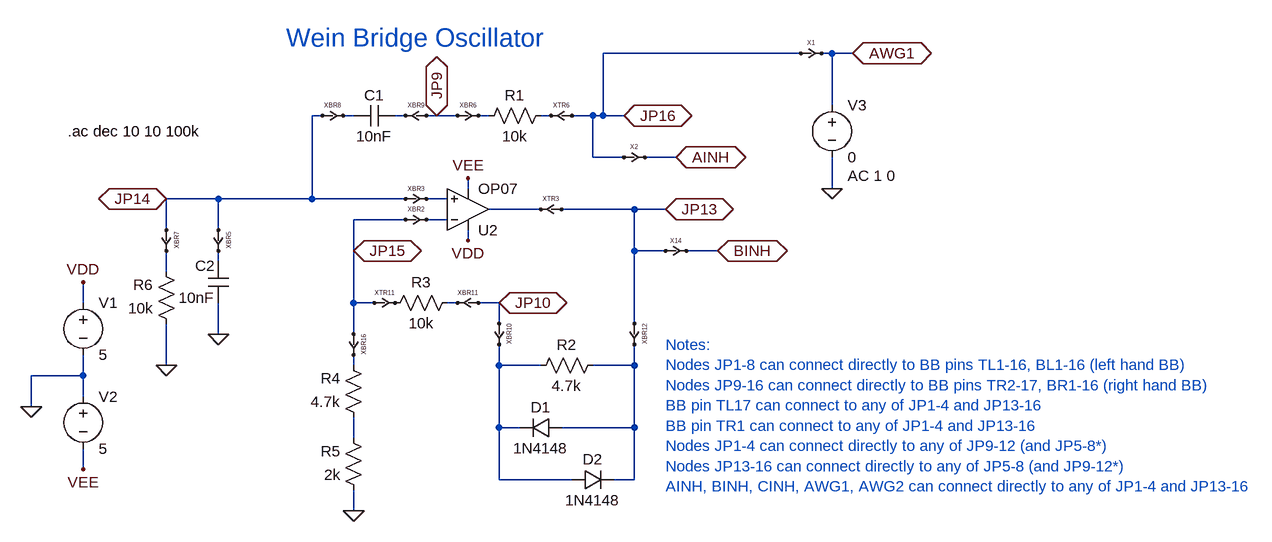
[diagram p0: schematic wien_bridge_osc_ac_response.asc]
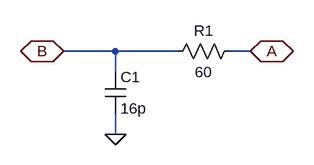
[diagram p1: sub-circuit cross_point.asc]
wien_bridge_osc_ac_response.asc, the LTspice schematic file:
Version 4
SHEET 1 1728 820
WIRE 768 0 464 0
WIRE 816 0 800 0
WIRE 848 0 816 0
WIRE 816 80 816 0
WIRE 32 96 16 96
WIRE 80 96 64 96
WIRE 160 96 144 96
WIRE 208 96 192 96
WIRE 240 96 208 96
WIRE 288 96 272 96
WIRE 384 96 368 96
WIRE 448 96 416 96
WIRE 464 96 464 0
WIRE 464 96 448 96
WIRE 496 96 464 96
WIRE 448 160 448 96
WIRE 496 160 448 160
WIRE 576 160 528 160
WIRE 256 208 256 192
WIRE 816 208 816 160
WIRE -128 224 -208 224
WIRE 16 224 16 96
WIRE 16 224 -128 224
WIRE 160 224 16 224
WIRE 224 224 192 224
WIRE 368 240 288 240
WIRE 512 240 400 240
WIRE 560 240 512 240
WIRE 160 256 80 256
WIRE 224 256 192 256
WIRE -208 272 -208 224
WIRE -128 272 -128 224
WIRE 256 288 256 272
WIRE 80 304 80 256
WIRE 512 304 512 240
WIRE 560 304 512 304
WIRE 640 304 592 304
WIRE -128 320 -128 304
WIRE -208 336 -208 304
WIRE -336 384 -336 352
WIRE 80 384 80 304
WIRE 112 384 80 384
WIRE 240 384 224 384
WIRE 304 384 272 384
WIRE 304 416 304 384
WIRE 512 416 512 304
WIRE -128 432 -128 384
WIRE 80 432 80 384
WIRE -208 480 -208 416
WIRE 80 480 80 464
WIRE 304 480 304 448
WIRE 368 480 304 480
WIRE 512 480 512 448
WIRE 512 480 448 480
WIRE -336 496 -336 464
WIRE -336 496 -416 496
WIRE -336 528 -336 496
WIRE -416 544 -416 496
WIRE 304 576 304 480
WIRE 336 576 304 576
WIRE 512 576 512 480
WIRE 512 576 400 576
WIRE 80 592 80 560
WIRE -336 640 -336 608
WIRE 304 656 304 576
WIRE 416 656 304 656
WIRE 512 656 512 576
WIRE 512 656 480 656
WIRE 80 704 80 672
FLAG -416 544 0
FLAG -336 352 VDD
FLAG 256 288 VDD
FLAG -336 640 VEE
FLAG 256 192 VEE
FLAG -128 432 0
FLAG -208 480 0
FLAG 80 704 0
FLAG 560 240 JP13
IOPIN 560 240 BiDir
FLAG 208 96 JP9
IOPIN 208 96 BiDir
FLAG 80 304 JP15
IOPIN 80 304 BiDir
FLAG 304 384 JP10
IOPIN 304 384 BiDir
FLAG -208 224 JP14
IOPIN -208 224 BiDir
FLAG 640 304 BINH
IOPIN 640 304 BiDir
FLAG 496 96 JP16
IOPIN 496 96 BiDir
FLAG 576 160 AINH
IOPIN 576 160 BiDir
FLAG 816 208 0
FLAG 848 0 AWG1
IOPIN 848 0 BiDir
SYMBOL voltage -336 368 R0
WINDOW 123 0 0 Left 0
WINDOW 39 0 0 Left 0
SYMATTR InstName V1
SYMATTR Value 5
SYMBOL voltage -336 512 R0
WINDOW 123 0 0 Left 0
WINDOW 39 0 0 Left 0
SYMATTR InstName V2
SYMATTR Value 5
SYMBOL res 384 80 R90
WINDOW 0 0 56 VBottom 2
WINDOW 3 32 56 VTop 2
SYMATTR InstName R1
SYMATTR Value 10k
SYMBOL res 464 464 R90
WINDOW 0 0 56 VBottom 2
WINDOW 3 32 56 VTop 2
SYMATTR InstName R2
SYMATTR Value 4.7k
SYMBOL res 240 368 R90
WINDOW 0 0 56 VBottom 2
WINDOW 3 32 56 VTop 2
SYMATTR InstName R3
SYMATTR Value 10k
SYMBOL res 96 576 R180
WINDOW 0 36 76 Left 2
WINDOW 3 36 40 Left 2
SYMATTR InstName R4
SYMATTR Value 4.7k
SYMBOL res 96 688 R180
WINDOW 0 36 76 Left 2
WINDOW 3 36 40 Left 2
SYMATTR InstName R5
SYMATTR Value 2k
SYMBOL cap 144 80 R90
WINDOW 0 0 32 VBottom 2
WINDOW 3 32 32 VTop 2
SYMATTR InstName C1
SYMATTR Value 10nF
SYMBOL cap -144 384 M180
WINDOW 0 -20 57 Left 2
WINDOW 3 -45 8 Left 2
SYMATTR InstName C2
SYMATTR Value 10nF
SYMBOL res -192 432 R180
WINDOW 0 36 76 Left 2
WINDOW 3 36 40 Left 2
SYMATTR InstName R6
SYMATTR Value 10k
SYMBOL diode 400 560 R90
WINDOW 0 0 32 VBottom 2
WINDOW 3 32 32 VTop 2
SYMATTR InstName D1
SYMATTR Value 1N4148
SYMBOL diode 416 672 R270
WINDOW 0 32 32 VTop 2
WINDOW 3 0 32 VBottom 2
SYMATTR InstName D2
SYMATTR Value 1N4148
SYMBOL cross_point 48 96 M0
SYMATTR InstName XBR8
SYMBOL cross_point 256 96 M0
SYMATTR InstName XBR6
SYMBOL cross_point 384 240 R0
SYMATTR InstName XTR3
SYMBOL cross_point 176 224 M0
SYMATTR InstName XBR3
SYMBOL cross_point 176 256 M0
SYMATTR InstName XBR2
SYMBOL cross_point 176 96 R0
SYMATTR InstName XBR9
SYMBOL cross_point 400 96 R0
SYMATTR InstName XTR6
SYMBOL cross_point -128 288 M270
SYMATTR InstName XBR5
SYMBOL cross_point 512 432 M270
SYMATTR InstName XBR12
SYMBOL cross_point 256 384 R0
SYMATTR InstName XBR11
SYMBOL cross_point 304 432 M270
SYMATTR InstName XBR10
SYMBOL cross_point 128 384 M0
SYMATTR InstName XTR11
SYMBOL cross_point 80 448 M270
SYMATTR InstName XBR16
SYMBOL cross_point 576 304 M0
SYMATTR InstName X14
SYMBOL OpAmps\\OP07 256 304 M180
SYMATTR InstName U2
SYMBOL cross_point -208 288 M270
SYMATTR InstName XBR7
SYMBOL cross_point 512 160 M0
SYMATTR InstName X2
SYMBOL voltage 816 64 R0
WINDOW 123 24 124 Left 2
WINDOW 39 0 0 Left 0
SYMATTR Value2 AC 1 0
SYMATTR InstName V3
SYMATTR Value 0
SYMBOL cross_point 784 0 M0
SYMATTR InstName X1
TEXT -360 120 Left 2 !.ac dec 10 10 100k
TEXT -24 -24 Left 4 ;Wein Bridge Oscillator
TEXT 560 448 Left 2 ;Notes:\nNodes JP1-8 can connect directly to BB pins TL1-16, BL1-16 (left hand BB)\nNodes JP9-16 can connect directly to BB pins TR2-17, BR1-16 (right hand BB)\nBB pin TL17 can connect to any of JP1-4 and JP13-16\nBB pin TR1 can connect to any of JP1-4 and JP13-16\nNodes JP1-4 can connect directly to any of JP9-12 (and JP5-8*)\nNodes JP13-16 can connect directly to any of JP5-8 (and JP9-12*)\nAINH, BINH, CINH, AWG1, AWG2 can connect directly to any of JP1-4 and JP13-16

cross_point.asc, the sub-circuit schematic file:
Version 4
SHEET 1 880 680
WIRE 80 160 0 160
WIRE 176 160 80 160
WIRE 288 160 256 160
WIRE 80 192 80 160
WIRE 80 288 80 256
FLAG 288 160 A
IOPIN 288 160 BiDir
FLAG 0 160 B
IOPIN 0 160 BiDir
FLAG 80 288 0
SYMBOL res 272 144 R90
WINDOW 0 0 56 VBottom 2
WINDOW 3 32 56 VTop 2
SYMATTR InstName R1
SYMATTR Value 60
SYMBOL cap 64 192 R0
SYMATTR InstName C1
SYMATTR Value 16p

The netlist it stands for:
* wien_bridge_osc_ac_response.asc
V1 VDD 0 5
V2 0 VEE 5
R1 N004 N003 10k
R2 N013 N012 4.7k
R3 N010 P001 10k
R4 N014 N011 4.7k
R5 0 N014 2k
C1 N002 N001 10nF
C2 0 N008 10nF
R6 0 N009 10k
D1 N013 N012 1N4148
D2 N012 N013 1N4148
XXBR8 JP14 N001 cross_point
XXBR6 JP9 N003 cross_point
XXTR3 JP13 N006 cross_point
XXBR3 JP14 N005 cross_point
XXBR2 JP15 N007 cross_point
XXBR9 JP9 N002 cross_point
XXTR6 JP16 N004 cross_point
XXBR5 JP14 N008 cross_point
XXBR12 JP13 N013 cross_point
XXBR11 JP10 N010 cross_point
XXBR10 JP10 N012 cross_point
XXTR11 JP15 P001 cross_point
XXBR16 JP15 N011 cross_point
XX14 JP13 BINH cross_point
XU2 N005 N007 VDD VEE N006 LT1001  ; OP07, pins In+ In- V+ V- OUT
XXBR7 JP14 N009 cross_point
XX2 JP16 AINH cross_point
V3 AWG1 0 0 AC 1 0
XX1 JP16 AWG1 cross_point

* block symbol definitions
.subckt cross_point A B
R1 A B 60
C1 B 0 16p
.ends cross_point

.model D D
.lib standard.dio
.ac dec 10 10 100k
* Wein Bridge Oscillator
* Notes:
* Nodes JP1-8 can connect directly to BB pins TL1-16, BL1-16 (left hand BB)
* Nodes JP9-16 can connect directly to BB pins TR2-17, BR1-16 (right hand BB)
* BB pin TL17 can connect to any of JP1-4 and JP13-16
* BB pin TR1 can connect to any of JP1-4 and JP13-16
* Nodes JP1-4 can connect directly to any of JP9-12 (and JP5-8*)
* Nodes JP13-16 can connect directly to any of JP5-8 (and JP9-12*)
* AINH, BINH, CINH, AWG1, AWG2 can connect directly to any of JP1-4 and JP13-16
.lib LTC.lib
.backanno
.end